# EAGLE design HInata-debug-board (EAGLE 9.6.2)
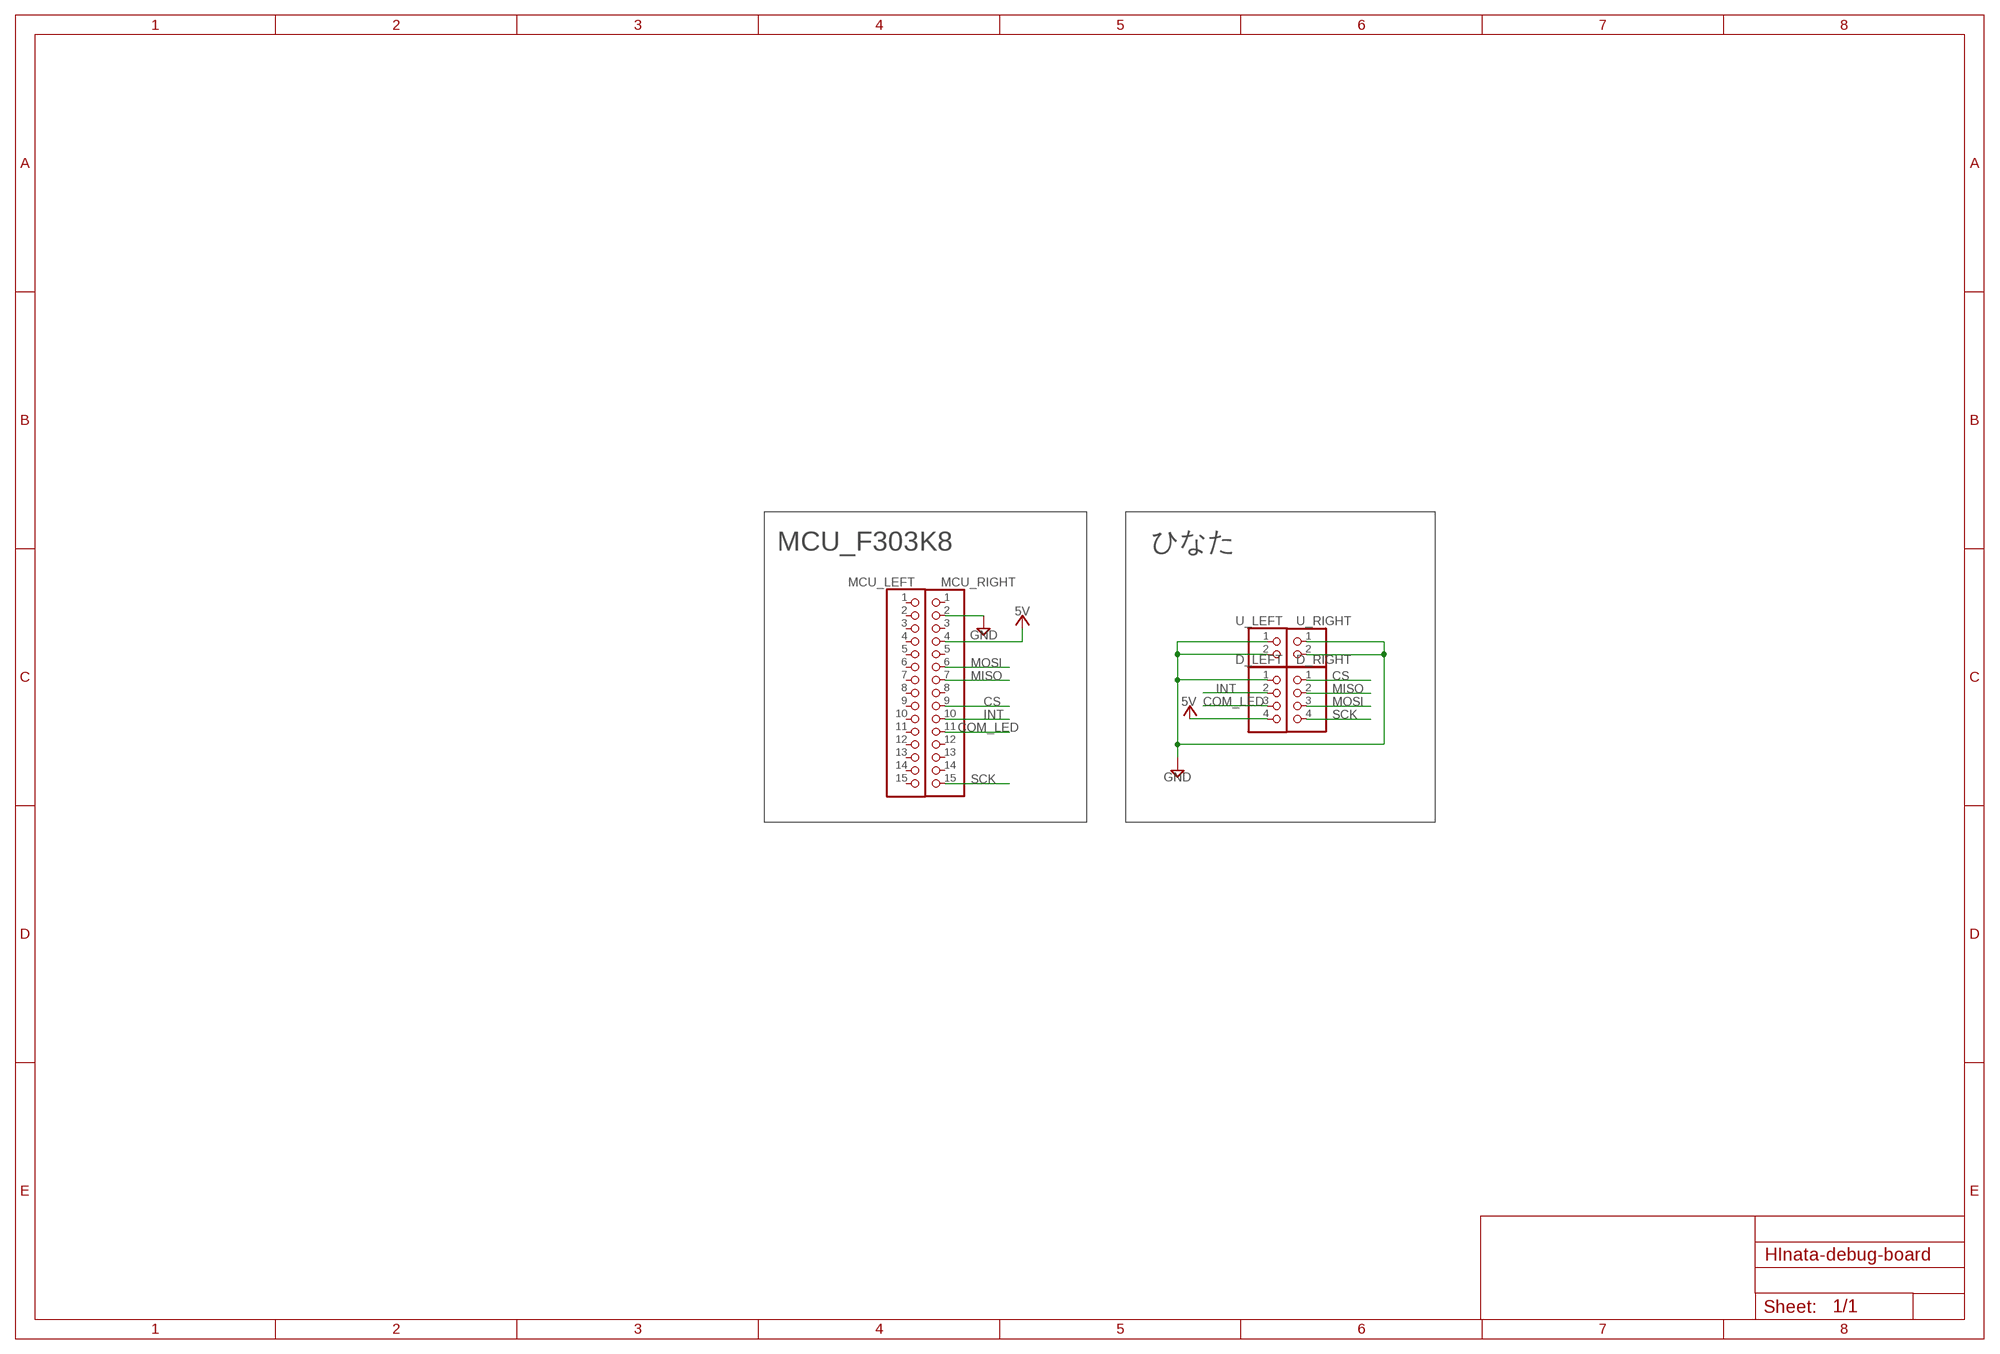
[diagram p0: schematic, sheet 1]

## Parts
D_LEFT  PINHD-1X4  [1X04]
D_RIGHT  PINHD-1X4  [1X04]
MCU_LEFT  PINHD-1X15  [1X15]
MCU_RIGHT  PINHD-1X15  [1X15]
U_LEFT  PINHD-1X2  [1X02]
U_RIGHT  PINHD-1X2  [1X02]

## Nets
5V: D_LEFT.4 MCU_RIGHT.4 ; supply symbol labelled VCC
COM_LED: D_LEFT.3 MCU_RIGHT.11
CS: D_RIGHT.1 MCU_RIGHT.9
GND: D_LEFT.1 MCU_RIGHT.2 U_LEFT.1 U_LEFT.2 U_RIGHT.1 U_RIGHT.2
INT: D_LEFT.2 MCU_RIGHT.10
MISO: D_RIGHT.2 MCU_RIGHT.7
MOSI: D_RIGHT.3 MCU_RIGHT.6
SCK: D_RIGHT.4 MCU_RIGHT.15
Unconnected: MCU_LEFT.1 MCU_LEFT.2 MCU_LEFT.3 MCU_LEFT.4 MCU_LEFT.5 MCU_LEFT.6 MCU_LEFT.7 MCU_LEFT.8 MCU_LEFT.9 MCU_LEFT.10 MCU_LEFT.11 MCU_LEFT.12 MCU_LEFT.13 MCU_LEFT.14 MCU_LEFT.15 MCU_RIGHT.1 MCU_RIGHT.3 MCU_RIGHT.5 MCU_RIGHT.8 MCU_RIGHT.12 MCU_RIGHT.13 MCU_RIGHT.14

## Notes on the sheet
- MCU_F303K8 | ひなた

## Library data of the parts
D_LEFT D_RIGHT = pinhead:PINHD-1X4: PIN HEADER
MCU_LEFT MCU_RIGHT = pinhead:PINHD-1X15: PIN HEADER
U_LEFT U_RIGHT = pinhead:PINHD-1X2: PIN HEADER

## Board
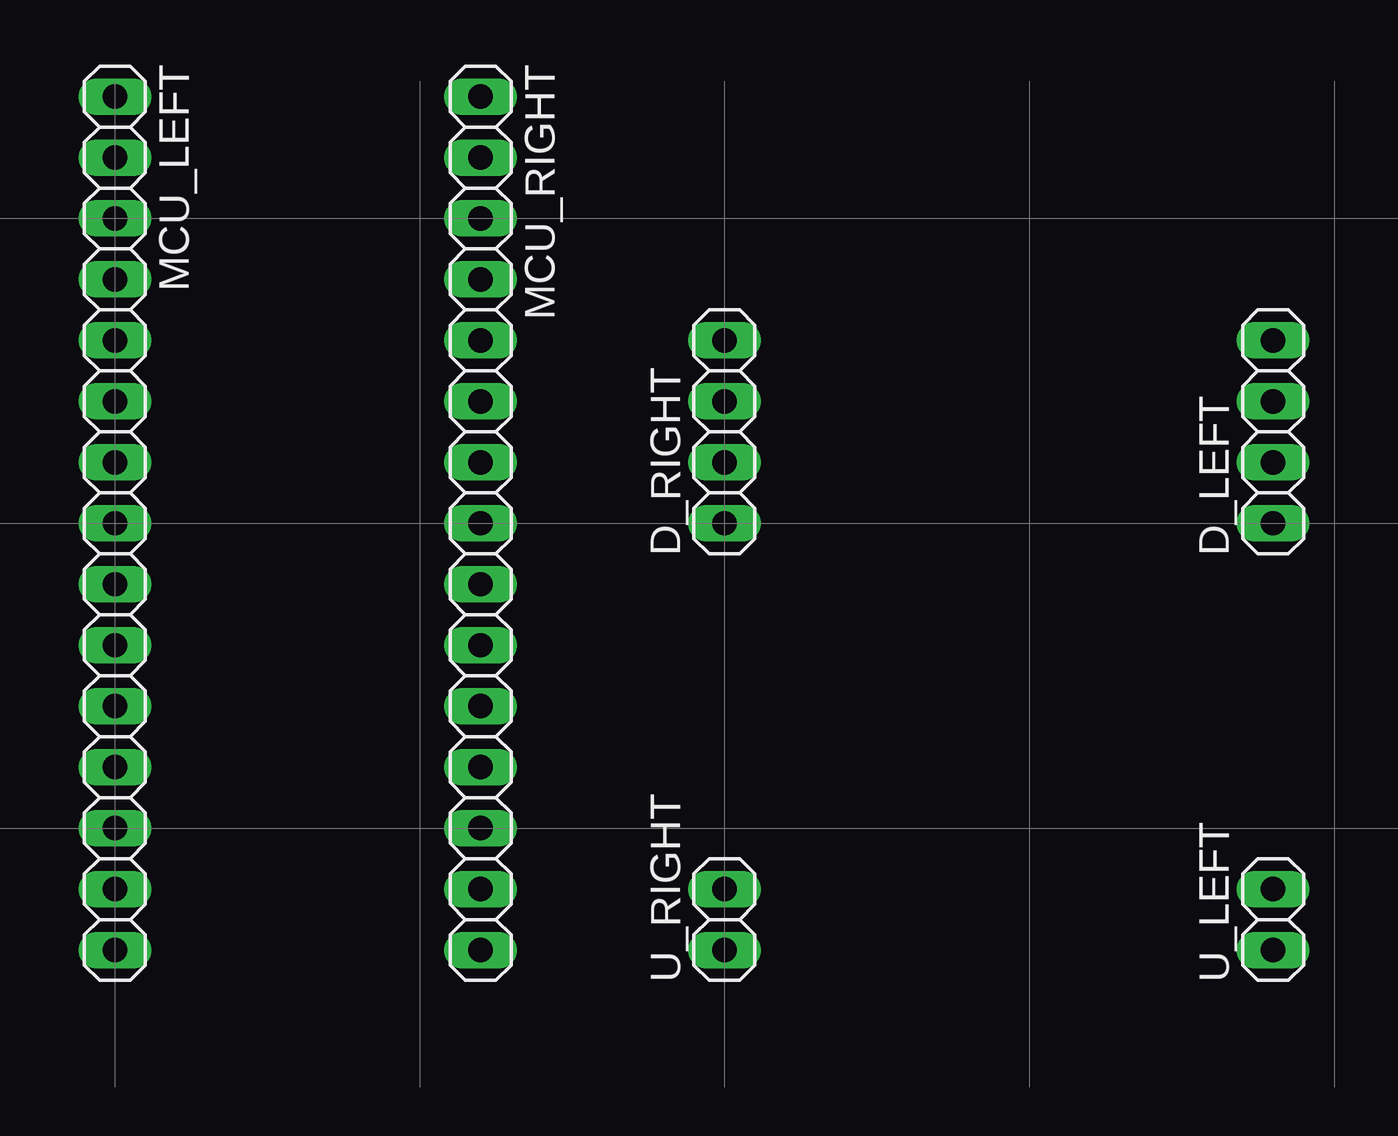
[diagram p1: board, top side]
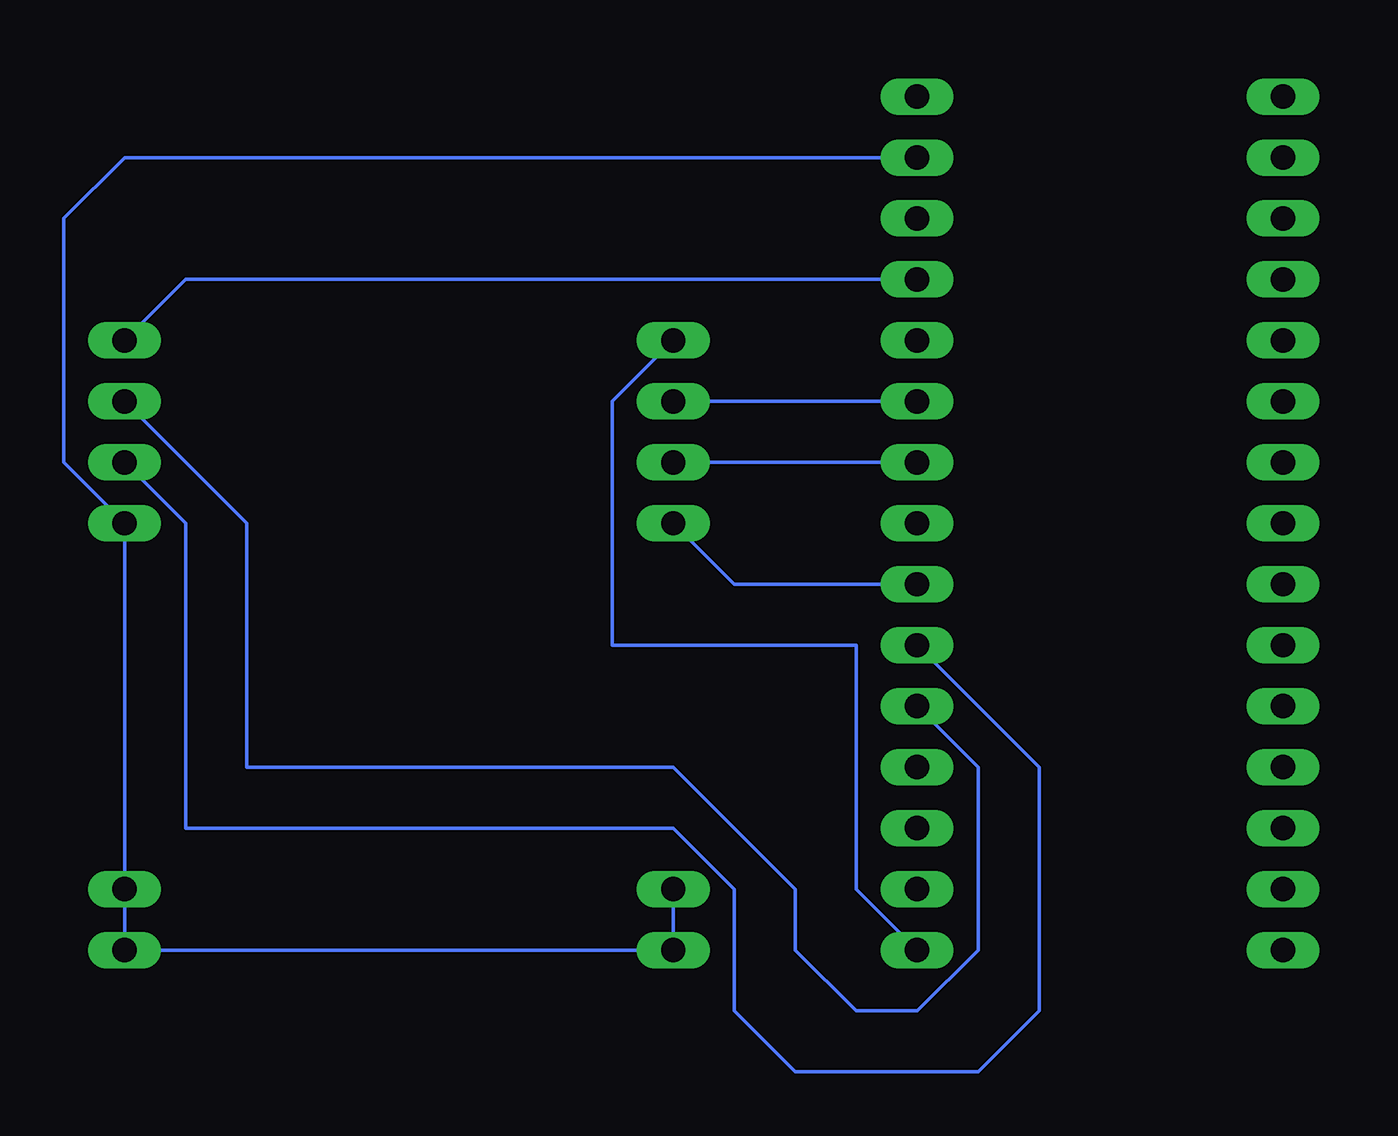
[diagram p2: board, bottom side, seen from below]

No outline drawn. Coordinates in mm, seen from the top.
Copper layers (1*16): Top 0.035mm / dielectric 1.5mm / Bottom 0.035mm
Design rules "default": minimum track width 6mil, minimum drill 0.35mm, track to track 6mil, track to pad 6mil, pad to pad 6mil, via to via 6mil, smd to smd 6mil, copper to edge 40mil, drill to drill 6mil, minimum pad ring 10mil, minimum via ring 8mil, stop-mask expansion 4mil, vias tented up to drill 0mil, thermal gap 10mil

### Footprints (pad centres in the part's own frame; a part is rotated, then mirrored left to right if it is on the bottom)
1X04 = drill 1.016 long: 1 -3.81,0; 2 -1.27,0; 3 1.27,0; 4 3.81,0
1X15 = drill 1.016 long: 1 -17.78,0; 2 -15.24,0; 3 -12.7,0; 4 -10.16,0; 5 -7.62,0; 6 -5.08,0; 7 -2.54,0; 8 0,0; 9 2.54,0; 10 5.08,0; 11 7.62,0; 12 10.16,0; 13 12.7,0; 14 15.24,0; 15 17.78,0
1X02 = drill 1.016 long: 1 -1.27,0; 2 1.27,0

### Placement (x,y rotation side)
D_LEFT  62.23,30.48 90 top
D_RIGHT  39.37,30.48 90 top
MCU_LEFT  13.97,26.67 270 top
MCU_RIGHT  29.21,26.67 270 top
U$1  [TYPE.C]  1.27,1.27 0 top
U_LEFT  62.23,10.16 90 top
U_RIGHT  39.37,10.16 90 top

### Tracks (layer width: path | path; a pad name or v marks a point on that pad's centre or on a via)
5V
  Bottom 0.152: D_LEFT.4 59.69,36.83 MCU_RIGHT.4
COM_LED
  Bottom 0.152: MCU_RIGHT.11 26.67,16.51 26.67,8.89 29.21,6.35 31.75,6.35 34.29,8.89 34.29,11.43 39.37,16.51 57.15,16.51 57.15,26.67 D_LEFT.3
CS
  Bottom 0.152: D_RIGHT.1 36.83,24.13 MCU_RIGHT.9
GND
  Bottom 0.152: U_RIGHT.2 U_RIGHT.1 U_LEFT.1 U_LEFT.2 D_LEFT.1 64.77,29.21 64.77,39.37 62.23,41.91 MCU_RIGHT.2
INT
  Bottom 0.152: MCU_RIGHT.10 24.13,16.51 24.13,6.35 26.67,3.81 34.29,3.81 36.83,6.35 36.83,11.43 39.37,13.97 59.69,13.97 59.69,26.67 D_LEFT.2
MISO
  Bottom 0.152: D_RIGHT.2 MCU_RIGHT.7
MOSI
  Bottom 0.152: D_RIGHT.3 MCU_RIGHT.6
SCK
  Bottom 0.152: D_RIGHT.4 41.91,31.75 41.91,21.59 31.75,21.59 31.75,11.43 MCU_RIGHT.15